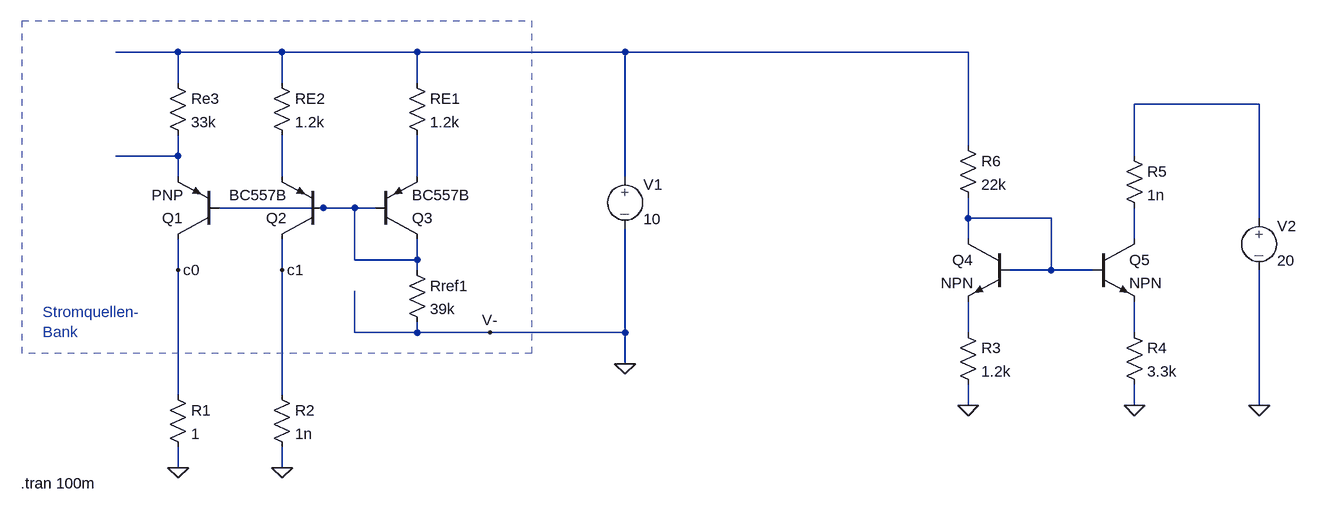
[diagram p0: schematic Stromquellenbank_pnp.asc]
Stromquellenbank_pnp.asc, the LTspice schematic file:
Version 4
SHEET 1 1072 680
WIRE -656 -176 -752 -176
WIRE -496 -176 -656 -176
WIRE -288 -176 -496 -176
WIRE 32 -176 -288 -176
WIRE 560 -176 32 -176
WIRE -656 -128 -656 -176
WIRE -496 -128 -496 -176
WIRE -288 -128 -288 -176
WIRE 1008 -96 816 -96
WIRE 560 -32 560 -176
WIRE -656 -16 -656 -48
WIRE -656 -16 -752 -16
WIRE 816 -16 816 -96
WIRE -656 16 -656 -16
WIRE -496 16 -496 -48
WIRE -288 16 -288 -48
WIRE 32 16 32 -176
WIRE -432 64 -592 64
WIRE -384 64 -432 64
WIRE -352 64 -384 64
WIRE 560 80 560 48
WIRE 688 80 560 80
WIRE 1008 80 1008 -96
WIRE 560 112 560 80
WIRE 816 112 816 64
WIRE -384 144 -384 64
WIRE -288 144 -288 112
WIRE -288 144 -384 144
WIRE -656 160 -656 112
WIRE -496 160 -496 112
WIRE -288 160 -288 144
WIRE 688 160 688 80
WIRE 688 160 624 160
WIRE 752 160 688 160
WIRE -384 256 -384 192
WIRE -288 256 -288 240
WIRE -288 256 -384 256
WIRE -176 256 -288 256
WIRE 32 256 32 96
WIRE 32 256 -176 256
WIRE 560 256 560 208
WIRE 816 256 816 208
WIRE 32 304 32 256
WIRE -656 352 -656 160
WIRE -496 352 -496 160
WIRE 560 368 560 336
WIRE 816 368 816 336
WIRE 1008 368 1008 160
WIRE -656 464 -656 432
WIRE -496 464 -496 432
FLAG -176 256 V-
FLAG -656 160 c0
FLAG -496 160 c1
FLAG -656 464 0
FLAG -496 464 0
FLAG 32 304 0
FLAG 560 368 0
FLAG 816 368 0
FLAG 1008 368 0
SYMBOL EIT_Semiconductors\\pnp -592 112 R180
SYMATTR InstName Q1
SYMBOL EIT_Semiconductors\\pnp -432 112 R180
SYMATTR InstName Q2
SYMATTR Value BC557B
SYMBOL EIT_Semiconductors\\pnp -352 112 M180
SYMATTR InstName Q3
SYMATTR Value BC557B
SYMBOL res -304 -144 R0
SYMATTR InstName RE1
SYMATTR Value 1.2k
SYMBOL res -512 -144 R0
SYMATTR InstName RE2
SYMATTR Value 1.2k
SYMBOL res -672 -144 R0
SYMATTR InstName Re3
SYMATTR Value 33k
SYMBOL res -304 144 R0
SYMATTR InstName Rref1
SYMATTR Value 39k
SYMBOL res -672 336 R0
SYMATTR InstName R1
SYMATTR Value 1
SYMBOL res -512 336 R0
SYMATTR InstName R2
SYMATTR Value 1n
SYMBOL source-V 32 0 R0
WINDOW 123 0 0 Left 0
WINDOW 39 0 0 Left 0
SYMATTR InstName V1
SYMATTR Value 10
SYMBOL EIT_Semiconductors\\npn 624 112 M0
SYMATTR InstName Q4
SYMBOL EIT_Semiconductors\\npn 752 112 R0
SYMATTR InstName Q5
SYMBOL res 544 240 R0
SYMATTR InstName R3
SYMATTR Value 1.2k
SYMBOL res 800 240 R0
SYMATTR InstName R4
SYMATTR Value 3.3k
SYMBOL res 800 -32 R0
SYMATTR InstName R5
SYMATTR Value 1n
SYMBOL source-V 1008 64 R0
WINDOW 123 0 0 Left 0
WINDOW 39 0 0 Left 0
SYMATTR InstName V2
SYMATTR Value 20
SYMBOL res 544 -48 R0
SYMATTR InstName R6
SYMATTR Value 22k
TEXT -864 224 Left 0 ;Stromquellen-\nBank
TEXT -898 488 Left 0 !.tran 100m
RECTANGLE Normal -112 288 -896 -224 2

The netlist it stands for:
* Stromquellenbank_pnp.asc
Q1 c0 N006 N003 0 PNP
Q2 c1 N006 N004 0 BC557B
Q3 N006 N006 N005 0 BC557B
RE1 N001 N005 1.2k
RE2 N001 N004 1.2k
Re3 N001 N003 33k
Rref1 N006 0 39k
R1 c0 0 1
R2 c1 0 1n
V1 N001 0 10
Q4 N007 N007 N009 0 NPN
Q5 N008 N007 N010 0 NPN
R3 N009 0 1.2k
R4 N010 0 3.3k
R5 N002 N008 1n
V2 N002 0 20
R6 N001 N007 22k
.model NPN NPN
.model PNP PNP
.lib standard.bjt
* Stromquellen-
* Bank
.tran 100m
.backanno
.end